# Altium schematic sheet 07_uart.SchDoc: KART : UART
size A4; DrawnBy: JNieto; DocumentNumber: 4; Revision: 1.0; SheetNumber: 10; SheetTotal: 10; Version: V 1.0.0
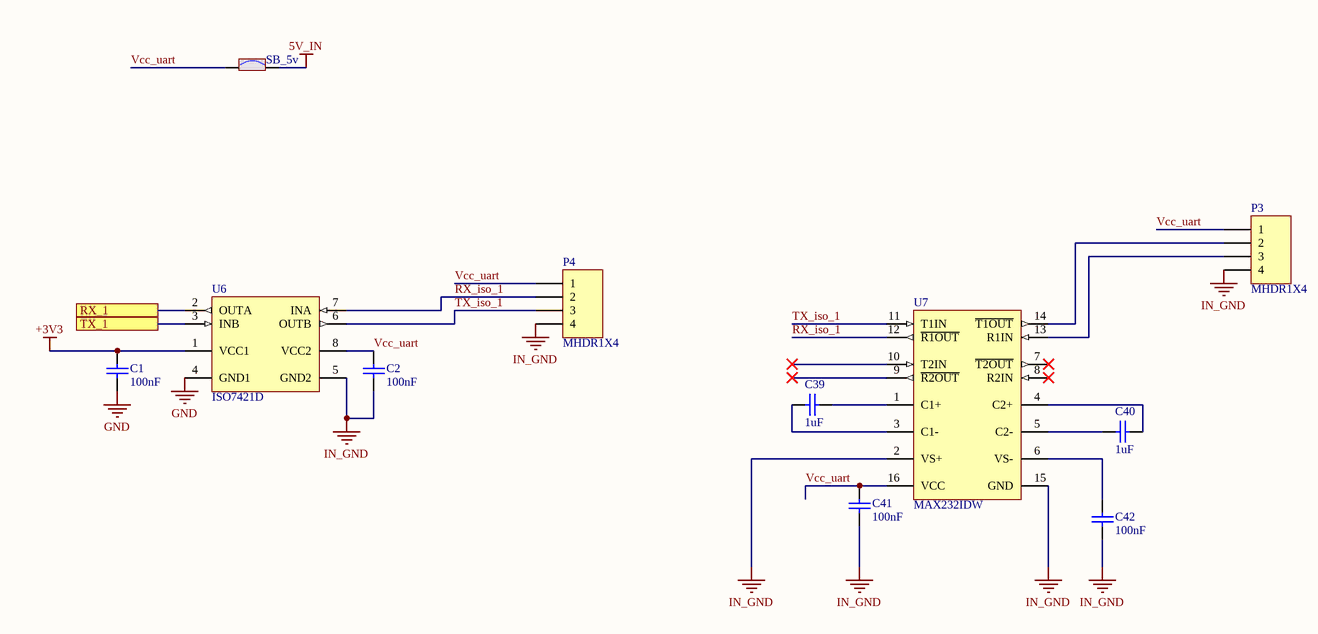
[diagram p0: 07_uart.SchDoc]

## Parts
C1  value 100nF  [C0603]  (hidden comment: Capacitor)
C2  value 100nF  [C0603]  (hidden comment: Capacitor)
C39  value 1uF  [C0603]
C40  value 1uF  [C0603]
C41  value 100nF  [C0603]  (hidden comment: Capacitor)
C42  value 100nF  [C0603]  (hidden comment: Capacitor)
P3  MHDR1X4  [MHDR1X4]
P4  MHDR1X4  [MHDR1X4]
SB_5v  (no value)  [SOLDER-BRIDGE_R0603-0R]
U6  ISO7421D  [D0008A_N]
U7  MAX232IDW  [TI-DW16_N]

## Ports
RX_1, TX_1

## Nets
5V_IN: SB_5v.2
+3V3: C1.2 U6.1(VCC1)
GND: C1.1 U6.4(GND1)
IN_GND: C2.1 C41.1 C42.1 P3.4 P4.4 U6.5(GND2) U7.2(VS+) U7.15(GND)
RX_1: U6.2(OUTA) ; port RX_1
RX_iso_1: P4.2 U6.7(INA) U7.12(~{R1OUT})
TX_1: U6.3(INB) ; port TX_1
TX_iso_1: P4.3 U6.6(OUTB) U7.11(T1IN)
Vcc_uart: C2.2 C41.2 P3.1 P4.1 SB_5v.1 U6.8(VCC2) U7.16(VCC)
NetC39_1: C39.1 U7.1(C1+)
NetC39_2: C39.2 U7.3(C1-)
NetC40_1: C40.1 U7.5(C2-)
NetC40_2: C40.2 U7.4(C2+)
NetC42_2: C42.2 U7.6(VS-)
NetP3_2: P3.2 U7.14(~{T1OUT})
NetP3_3: P3.3 U7.13(R1IN)

Not connected (* = marked no-connect by the designer): U7 7(~{T2OUT})* 8(R2IN)* 9(~{R2OUT})* 10(T2IN)*

## Library data of the parts
C1 C2 = MCD-00102: Capacitor, MLCC, 100nF, 16V, X7R, 10%, 0402, T=0,5mm; Manufacturer_Part_Number: CC0402KRX7R7BB104; Manufacturer: YAGEO; Alternate_Manufacturer_Part_Number: GCM155R71C104KA55D; Alternate_Manufacturer: MURATA; Provided_By: SUBCO; Internal_Part_Number: MCD-00102; Status: Released; Part_Type: Capacitor; Package: C0402; ComponentLink1Description: Datasheet; ComponentLink1URL: http://tunmcdsvn.tun.st.com/Component_Datasheet_Library/Trunk/Capacitors/Yageo_Multilayer_Capacitor_X7R_series_100pF_to_22uF
C39 C40 = MCD-01121: Capacitor, MLCC, 1µF, 10V, X5R, 20%, 0603, T=0,8mm; Manufacturer_Part_Number: GRM188R61A475ME15; Manufacturer: MURATA; ECCN_US: EAR99; ECCN_EU: NEC; Provided_By: Subcon; Initial_Board_Reference: MB1361; Internal_Part_Number: MCD-01121; Status: Released; Part_Type: Capacitor; Package: C0603; ComponentLink1Description: Datasheet; ComponentLink1URL: http://tunmcdsvn.tun.st.com/Component_Datasheet_Library/Trunk/Capacitors/Murata_Capacitor_GR_series
C41 C42 = MCD-00010: Capacitor, MLCC, 100nF, 16V, X5R, 10%, 0603, T=0,8mm; Manufacturer_Part_Number: CC0603KRX5R7BB105; Manufacturer: YAGEO; Provided_By: SUBCO; Internal_Part_Number: MCD-00010; Status: Released; Part_Type: Capacitor; Package: C0603; ComponentLink1Description: Datasheet; ComponentLink1URL: http://tunmcdsvn.tun.st.com/Component_Datasheet_Library/Trunk/Capacitors/Yageo_Multilayer_capacitor_X5R_series_100pF_to_100uF
P3 P4 = MHDR1X4: Header, 4-Pin; LatestRevisionDate: 17-Jul-2002; LatestRevisionNote: Re-released for DXP Platform.; Publisher: Altium Limited
SB_5v = MCD-00071: Solder Bridge ON; Part_Type: Mechanical; Provided_By: Subcon; Initial_Board_Reference: MB1274; Internal_Part_Number: MCD-00071; ECCN_US: n/a; ECCN_EU: n/a; Status: Released; ComponentLink1Description: Datasheet
U6 = ISO7421D: 1 Mbps Dual Channels, 1 / 1, Digital Isolator, 3.3 V / 5 V, -40 to +105 degC, 8-pin SOIC (D), Green (RoHS & no Sb/Br); Manufacturer: Texas Instruments; Datarate(Mbps): 1; Input Noise Filter: None; Insulation Rating(VRMS): 2500; Prop Delay(Max)(ns): 12; Rating: Catalog; Supply Voltage(s)(V): 3.3, 5; TTL/CMOS Input Threshold: TTL; DatasheetVersion: SLLS984E; PackageVersion: 4040047-3/M, 06/2011; PackageReference: D0008A; PackageDescription: 8-Pin Plastic Small Outline, Body 4.9 x 3.9 mm, Pitch 1.27 mm; Supplier 1: Digi-Key; Supplier Part Number 1: 296-25187-5-ND; Supplier 2: Farnell; Supplier Part Number 2: 2335668; Supplier 3: Newark; Supplier Part Number 3: 96W6898; Supplier 4: Newark; Supplier Part Number 4: 33R2484; Supplier 5: Mouser; Supplier Part Number 5: 595-ISO7421D; SubFamily: Isolator; Thermal Shutdown: No; MountType: SMT; Code_JEDEC: MS-012; PartNumber: ISO7421D; ComponentLink1Description: Manufacturer URL; ComponentLink1URL: http://www.ti.com/; ComponentLink2Description: Datasheet; ComponentLink2URL: http://www.ti.com/general/docs/lit/getliterature.tsp?genericPartNumber=ISO7421&fileType=pdf; ComponentLink3Description: Package Specification; ComponentLink3URL: http://www.ti.com/litv/pdf/msoi002j; ComponentLink4Description: SamplesURL; ComponentLink4URL: http://www.ti.com/product/iso7421#samples
U7 = MAX232IDW: Dual EIA-232 Driver / Receiver, -40 to 85 degC, 16-Pin SOIC (DW), Green (RoHS & no Sb/Br); SubFamily: RS-232; Drivers Per Package: 2; Supply Voltage(s)(V): 5; ESD HBM(kV): +/-2; ICC(Max)(mA): 10; Single Supply: TRUE; DatasheetVersion: SLLS047L; PackageVersion: revG, Jan-2011; PackageReference: DW16; PackageDescription: 16-Pin Small Outline Integrated Circuit, 10.3 x 7.5 mm, Pitch 1.27 mm Pitch; Receivers Per Package: 2; RS-232: TRUE; ComponentLink1Description: Manufacturer URL; ComponentLink1URL: www.ti.com; ComponentLink2Description: Datasheet; ComponentLink2URL: http://www.ti.com/general/docs/lit/getliterature.tsp?genericPartNumber=MAX232&fileType=pdf; ComponentLink3Description: Package Specification; ComponentLink3URL: http://www.ti.com/litv/pdf/msoi003g